# EAGLE design ISPnub_v1.1 (EAGLE 7.2.0)
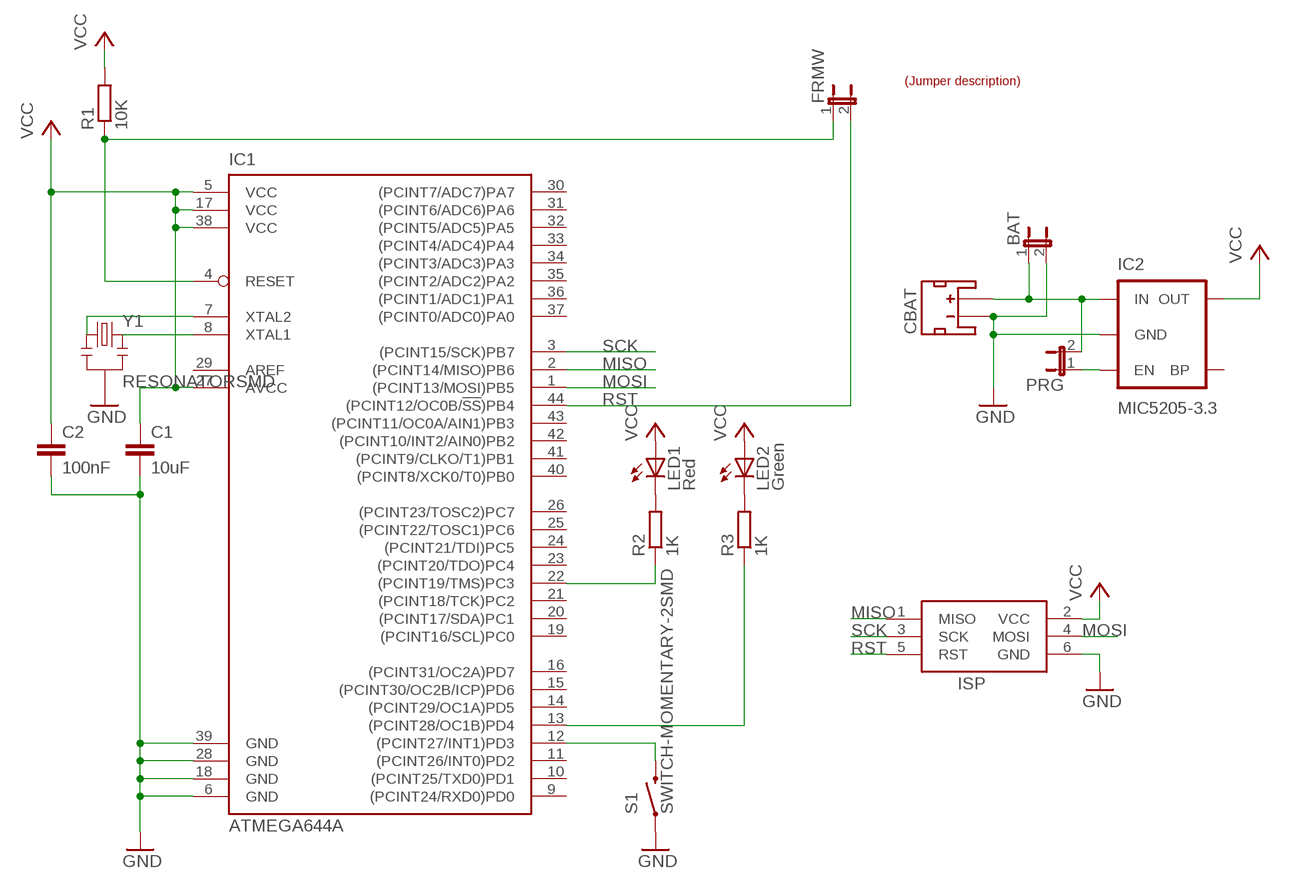
[diagram p0: schematic, sheet 1]

## Parts
BAT  JP1E  [JP1]
C1  10uF  C-EUC0805  [C0805]
C2  100nF  C-EUC0805  [C0805]
CBAT  JST PH SMT  JST_2MM_MALE  [JST-2-SMD]
FRMW  JP1E  [JP1]
IC1  ATMEGA644A  [TQFP44]
IC2  MIC5205-3.3  V_REG_LDOSMD  [SOT23-5]
ISP  AVRISP-6  [AVRISP]
LED1  Red  LEDCHIP-LED0805  [CHIP-LED0805]
LED2  Green  LEDCHIP-LED0805  [CHIP-LED0805]
PRG  JP1E  [JP1]
R1  10K  R-EU_R0805  [R0805]
R2  1K  R-EU_R0805  [R0805]
R3  1K  R-EU_R0805  [R0805]
S1  SWITCH-MOMENTARY-2SMD  [TACTILE_SWITCH_SMD]
U$1  LABEL_JUMPER_1X2  [JUMP2_DESC]
Y1  RESONATORSMD  [RESONATOR-SMD]

## Nets
GND: BAT.2 C1.2 C2.2 CBAT.1(-) IC1.6(GND) IC1.18(GND) IC1.28(GND) IC1.39(GND) IC2.2(GND) ISP.6(GND) S1.1 Y1.2
MISO: IC1.2((PCINT14/MISO)PB6) ISP.1(MISO)
MOSI: IC1.1((PCINT13/MOSI)PB5) ISP.4(MOSI)
N$1: FRMW.1 IC1.4(RESET) R1.1
N$2: IC1.8(XTAL1) Y1.3
N$3: IC1.7(XTAL2) Y1.1
N$4: IC1.12((PCINT27/INT1)PD3) S1.3
N$5: IC1.13((PCINT28/OC1B)PD4) R3.1
N$6: LED2.C R3.2
N$7: IC1.22((PCINT19/TMS)PC3) R2.1
N$8: LED1.C R2.2
N$9: BAT.1 CBAT.2(+) IC2.1(IN) PRG.2
N$10: IC2.3(EN) PRG.1
RST: FRMW.2 IC1.44((PCINT12/OC0B/!SS!)PB4) ISP.5(RST)
SCK: IC1.3((PCINT15/SCK)PB7) ISP.3(SCK)
VCC: C1.1 C2.1 IC1.5(VCC) IC1.17(VCC) IC1.27(AVCC) IC1.38(VCC) IC2.5(OUT) ISP.2(VCC) LED1.A LED2.A R1.2
Unconnected: CBAT.NC1(PAD1) CBAT.NC2(PAD2) IC1.9((PCINT24/RXD0)PD0) IC1.10((PCINT25/TXD0)PD1) IC1.11((PCINT26/INT0)PD2) IC1.14((PCINT29/OC1A)PD5) IC1.15((PCINT30/OC2B/ICP)PD6) IC1.16((PCINT31/OC2A)PD7) IC1.19((PCINT16/SCL)PC0) IC1.20((PCINT17/SDA)PC1) IC1.21((PCINT18/TCK)PC2) IC1.23((PCINT20/TDO)PC4) IC1.24((PCINT21/TDI)PC5) IC1.25((PCINT22/TOSC1)PC6) IC1.26((PCINT23/TOSC2)PC7) IC1.29(AREF) IC1.30((PCINT7/ADC7)PA7) IC1.31((PCINT6/ADC6)PA6) IC1.32((PCINT5/ADC5)PA5) IC1.33((PCINT4/ADC4)PA4) IC1.34((PCINT3/ADC3)PA3) IC1.35((PCINT2/ADC2)PA2) IC1.36((PCINT1/ADC1)PA1) IC1.37((PCINT0/ADC0)PA0) IC1.40((PCINT8/XCK0/T0)PB0) IC1.41((PCINT9/CLKO/T1)PB1) IC1.42((PCINT10/INT2/AIN0)PB2) IC1.43((PCINT11/OC0A/AIN1)PB3) IC2.4(BP)

## Library data of the parts
BAT FRMW PRG = jumper:JP1E: JUMPER; MOUSER#: 571-826936-2
C1 C2 = rcl:C-EU: CAPACITOR, European symbol; MOUSER#: 80-C0805C104K5R
CBAT = SparkFun-Connectors:JST_2MM_MALE: Mates to single-cell LiPo batteries. CONN-08352; PROD_ID: CONN-08352
IC1 = atmel:ATMEGA644: 8-bit Microcontroller with 64K Bytes In-System Programmable Flash Source: http://www.atmel.com/dyn/resources/prod_documents/doc2593.pdf; MOUSER#: 556-ATMEGA1284P-AU; MPN: ATMEGA1284PV-10AU; OC_FARNELL: 1455123; OC_NEWARK: 58M3748
IC2 = Arduino-Pro-Mini-v14Arduino-Pro-Mini:V_REG_LDO: Voltage Regulator LDO Standard 150mA LDO voltage regulator in SOT-23 layout. Micrel part MIC5205. BP (by-pass) pin is used to lower output noise with 470pF cap.
ISP = adafruit:AVRISP: AVR ISP HEADER Standard 6 pin header for AVR programming
LED1 = led:LED: LED OSRAM: - CHIPLED LG R971, LG N971, LY N971, LG Q971, LY Q971, LO R971, LY R971 LH N974, LH R974 LS Q976, LO Q976, LY Q976 LO Q996 - Hyper CHIPLED LW Q18S LB Q993, LB Q99A, LB R99A - SideLED LS A670, LO A670, LY A670, LG A670, LP A670 LB A673, LV A673, LT A673, LW A673 LH A674 LY A675 LS A676, LA A676, LO A676, LY A676, LW A676 LS A679, LY A679, LG A679 - Hyper Micro SIDELED® LS Y876, LA Y876, LO Y876, LY Y876 LT Y87S - SmartLED LW L88C, LW L88S LB L89C, LB L89S, LG L890 LS L89K, LO L89K, LY L89K LS L896, LA L896, LO L896, LY L896 - TOPLED LS T670, LO T670, LY T670, LG T670, LP T670 LSG T670, LSP T670, LSY T670, LOP T670, LYG T670 LG T671, LOG T671, LSG T671 LB T673, LV T673, LT T673, LW T673 LH T674 LS T676, LA T676, LO T676, LY T676, LB T676, LH T676, LSB T676, LW T676 LB T67C, LV T67C, LT T67C, LS T67K, LO T67K, LY T67K, LW E67C LS E67B, LA E67B, LO E67B, LY E67B, LB E67C, LV E67C, LT E67C LW T67C LS T679, LY T679, LG T679 LS T770, LO T770, LY T770, LG T770, LP T770 LB T773, LV T773, LT T773, LW T773 LH T774 LS E675, LA E675, LY E675, LS T675 LS T776, LA T776, LO T776, LY T776, LB T776 LHGB T686 LT T68C, LB T68C - Hyper Mini TOPLED® LB M676 - Mini TOPLED Santana® LG M470 LS M47K, LO M47K, LY M47K Source: http://www.osram.convergy.de LUXEON: - LUMILED® LXK2-PW12-R00, LXK2-PW12-S00, LXK2-PW14-U00, LXK2-PW14-V00 LXK2-PM12-R00, LXK2-PM12-S00, LXK2-PM14-U00 LXK2-PE12-Q00, LXK2-PE12-R00, LXK2-PE12-S00, LXK2-PE14-T00, LXK2-PE14-U00 LXK2-PB12-K00, LXK2-PB12-L00, LXK2-PB12-M00, LXK2-PB14-N00, LXK2-PB14-P00, LXK2-PB14-Q00 LXK2-PR12-L00, LXK2-PR12-M00, LXK2-PR14-Q00, LXK2-PR14-R00 LXK2-PD12-Q00, LXK2-PD12-R00, LXK2-PD12-S00 LXK2-PH12-R00, LXK2-PH12-S00 LXK2-PL12-P00, LXK2-PL12-Q00, LXK2-PL12-R00 Source: www.luxeon.com KINGBRIGHT: KA-3528ASYC Source: www.kingbright.com; MOUSER#: 604-APT1608SURC
LED2 = led:LED: LED OSRAM: - CHIPLED LG R971, LG N971, LY N971, LG Q971, LY Q971, LO R971, LY R971 LH N974, LH R974 LS Q976, LO Q976, LY Q976 LO Q996 - Hyper CHIPLED LW Q18S LB Q993, LB Q99A, LB R99A - SideLED LS A670, LO A670, LY A670, LG A670, LP A670 LB A673, LV A673, LT A673, LW A673 LH A674 LY A675 LS A676, LA A676, LO A676, LY A676, LW A676 LS A679, LY A679, LG A679 - Hyper Micro SIDELED® LS Y876, LA Y876, LO Y876, LY Y876 LT Y87S - SmartLED LW L88C, LW L88S LB L89C, LB L89S, LG L890 LS L89K, LO L89K, LY L89K LS L896, LA L896, LO L896, LY L896 - TOPLED LS T670, LO T670, LY T670, LG T670, LP T670 LSG T670, LSP T670, LSY T670, LOP T670, LYG T670 LG T671, LOG T671, LSG T671 LB T673, LV T673, LT T673, LW T673 LH T674 LS T676, LA T676, LO T676, LY T676, LB T676, LH T676, LSB T676, LW T676 LB T67C, LV T67C, LT T67C, LS T67K, LO T67K, LY T67K, LW E67C LS E67B, LA E67B, LO E67B, LY E67B, LB E67C, LV E67C, LT E67C LW T67C LS T679, LY T679, LG T679 LS T770, LO T770, LY T770, LG T770, LP T770 LB T773, LV T773, LT T773, LW T773 LH T774 LS E675, LA E675, LY E675, LS T675 LS T776, LA T776, LO T776, LY T776, LB T776 LHGB T686 LT T68C, LB T68C - Hyper Mini TOPLED® LB M676 - Mini TOPLED Santana® LG M470 LS M47K, LO M47K, LY M47K Source: http://www.osram.convergy.de LUXEON: - LUMILED® LXK2-PW12-R00, LXK2-PW12-S00, LXK2-PW14-U00, LXK2-PW14-V00 LXK2-PM12-R00, LXK2-PM12-S00, LXK2-PM14-U00 LXK2-PE12-Q00, LXK2-PE12-R00, LXK2-PE12-S00, LXK2-PE14-T00, LXK2-PE14-U00 LXK2-PB12-K00, LXK2-PB12-L00, LXK2-PB12-M00, LXK2-PB14-N00, LXK2-PB14-P00, LXK2-PB14-Q00 LXK2-PR12-L00, LXK2-PR12-M00, LXK2-PR14-Q00, LXK2-PR14-R00 LXK2-PD12-Q00, LXK2-PD12-R00, LXK2-PD12-S00 LXK2-PH12-R00, LXK2-PH12-S00 LXK2-PL12-P00, LXK2-PL12-Q00, LXK2-PL12-R00 Source: www.luxeon.com KINGBRIGHT: KA-3528ASYC Source: www.kingbright.com; MOUSER#: 604-APT2012SGC
R1 = rcl:R-EU_: RESISTOR, European symbol; MOUSER#: 603-SR0805JR-0710KL
R2 R3 = rcl:R-EU_: RESISTOR, European symbol; MOUSER#: 71-CRCW0805-1.0K-E3
S1 = Arduino-Pro-Mini-v14Arduino-Pro-Mini:SWITCH-MOMENTARY-2: Various NO switches- pushbuttons, reed, etc; MOUSER#: 693-1301.9314; PROD_ID: SWCH-08247
U$1 = dp_devices:LABEL_JUMPER_1X2: Nice formatted two legged jumperdescription Use attributes to change the values ON = With jumper OFF = Without jumper; OFF: Normal; ON: Update Firmware
Y1 = Arduino-Pro-Mini-v14Arduino-Pro-Mini:RESONATOR: Resonator Small SMD resonator. This is the itty bitty 10/20MHz resonators with built in caps. CSTCE10M0G55 and CSTCE20M0V53. Footprint for SMD has been used in SFE production for years, and does work okay. 1:1 is an attempt to get larger fillets on the sides so it will be easier to inspect these solders in our AOI machine. The pads have been minimized to match the actual metal under the resonator. To see this relation, it includes an image import of the bottom side of the component. Imported to scale on layer 200.

## Board
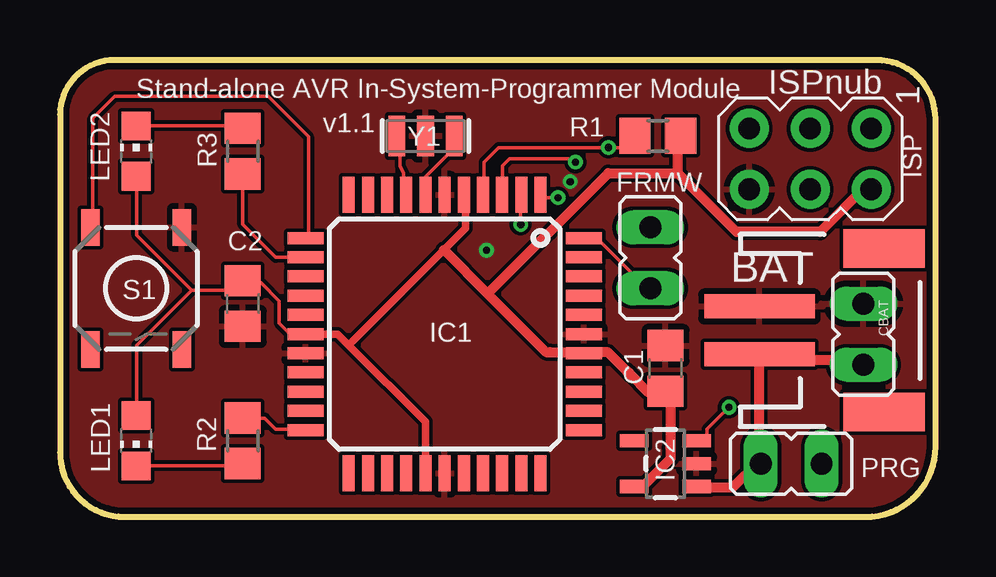
[diagram p1: board, top side]
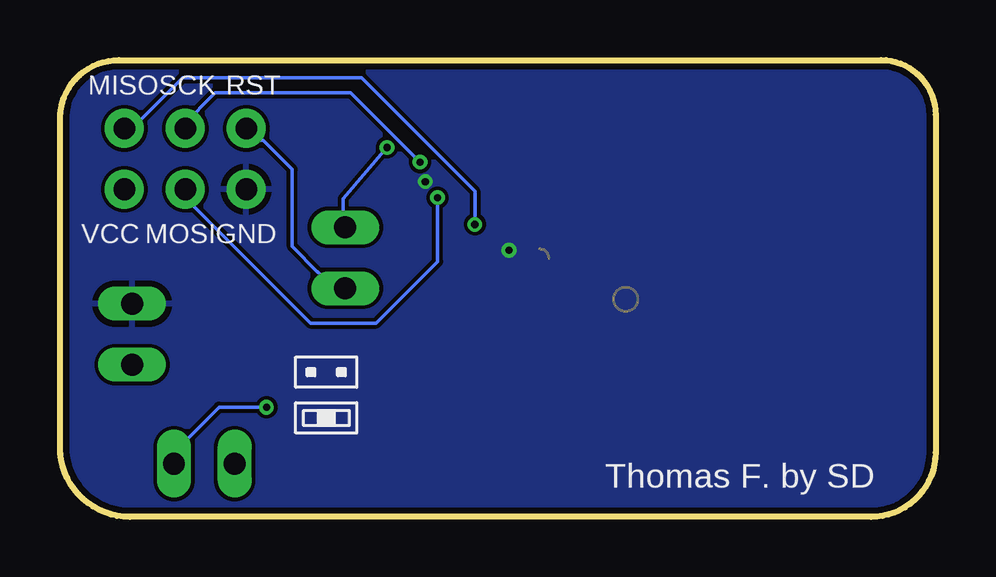
[diagram p2: board, bottom side, seen from below]

Size 36.5 x 19.04 mm. Coordinates in mm from the lower left corner, seen from the top.
Outline: 0,16.76 0,2.69 arc90 2.69,0 33.58,0 arc90 36.5,2.92 36.5,16.58 arc90 34.04,19.04 2.28,19.04 arc90 0,16.76
Copper layers (1*16): Top 0.035mm / dielectric 1.5mm / Bottom 0.035mm
Design rules "Elecrow_2-layer_eagle_rule": minimum track width 6mil, minimum drill 12mil, track to track 6mil, track to pad 6mil, pad to pad 6mil, via to via 6mil, smd to smd 0mil, copper to edge 10mil, drill to drill 10mil, minimum pad ring 10mil, minimum via ring 6mil, stop-mask expansion 2mil, vias tented up to drill 100mil, thermal gap 10mil

### Footprints (pad centres in the part's own frame; a part is rotated, then mirrored left to right if it is on the bottom)
JP1 = drill 0.914 long: 1 0,-1.27; 2 0,1.27
C0805 = smd 1.3 x 1.5: 1 -0.95,0; 2 0.95,0
JST-2-SMD = smd 1 x 4.6: 1 -1,-3.7; 2 1,-3.7 | smd 1.6 x 3.4: NC1 -3.4,1.5; NC2 3.4,1.5
TQFP44 = smd 1.5 x 0.5: 1 -5.8,4; 2 -5.8,3.2; 3 -5.8,2.4; 4 -5.8,1.6; 5 -5.8,0.8; 6 -5.8,0; 7 -5.8,-0.8; 8 -5.8,-1.6; 9 -5.8,-2.4; 10 -5.8,-3.2; 11 -5.8,-4; 23 5.8,-4; 24 5.8,-3.2; 25 5.8,-2.4; 26 5.8,-1.6; 27 5.8,-0.8; 28 5.8,0; 29 5.8,0.8; 30 5.8,1.6; 31 5.8,2.4; 32 5.8,3.2; 33 5.8,4 | smd 0.5 x 1.5: 12 -4,-5.8; 13 -3.2,-5.8; 14 -2.4,-5.8; 15 -1.6,-5.8; 16 -0.8,-5.8; 17 0,-5.8; 18 0.8,-5.8; 19 1.6,-5.8; 20 2.4,-5.8; 21 3.2,-5.8; 22 4,-5.8; 34 4,5.8; 35 3.2,5.8; 36 2.4,5.8; 37 1.6,5.8; 38 0.8,5.8; 39 0,5.8; 40 -0.8,5.8; 41 -1.6,5.8; 42 -2.4,5.8; 43 -3.2,5.8; 44 -4,5.8
SOT23-5 = smd 0.55 x 1.2: 1 -0.95,-1.3; 2 0,-1.3; 3 0.95,-1.3; 4 0.95,1.3; 5 -0.95,1.3
AVRISP = drill 0.9 pad 1.626: 1 -1.27,2.54; 2 1.27,2.54; 3 -1.27,0; 4 1.27,0; 5 -1.27,-2.54; 6 1.27,-2.54
CHIP-LED0805 = smd 1.2 x 1.2: A 0,-1.05; C 0,1.05
R0805 = smd 1.3 x 1.5: 1 -0.95,0; 2 0.95,0
TACTILE_SWITCH_SMD = smd 1.524 x 0.762: 1 -2.54,1.905; 2 2.54,1.905; 3 -2.54,-1.905; 4 2.54,-1.905
RESONATOR-SMD = smd 0.7 x 1.7: 1 -1.2,0; 2 0,0; 3 1.2,0

### Placement (x,y rotation side)
BAT  33.5,7.62 0 top
C1  25.24,6.19 90 top
C2  7.62,8.89 270 top
CBAT  32.86,7.78 270 top
FRMW  24.61,10.79 180 top
IC1  16.03,7.62 270 top
IC2  25.24,2.22 90 top
ISP  31.27,14.92 270 top
LED1  3.17,3.17 180 top
LED2  3.17,15.24 0 top
PRG  30.48,2.22 90 top
R1  24.92,15.88 0 top
R2  7.62,3.17 270 top
R3  7.62,15.24 90 top
S1  3.17,9.53 270 top
U$1  22.86,4.76 0 bottom
U$2  [LOGO]  20.32,8.57 0 bottom
Y1  15.24,15.88 180 top

### Tracks (layer width: path | path; a pad name or v marks a point on that pad's centre or on a via)
GND  (via drill 0.3)
  other vias: 17.78,11.11 21.27,13.97
  pour Top: 0,0 36.83,0 36.83,19.68 0,19.68
  pour Bottom: 0,0 36.83,0 36.83,19.68 0,19.68
MISO  (via drill 0.3)
  Top 0.152: v19.2,12.19 19.2,13.41 IC1.2
  Bottom 0.152: v19.2,12.19 19.2,13.58 23.93,18.3 31.38,18.3 33.38,16.31 33.68,16.31 ISP.1
MOSI  (via drill 0.3)
  Top 0.152: v20.76,13.3 20.12,13.3 20.12,13.41 IC1.1
  Bottom 0.152: v20.76,13.3 20.76,10.64 23.32,8.08 26.06,8.08 31.24,13.26 31.24,13.56 ISP.4
N$1  (via drill 0.3)
  Top 0.152: 22.71,15.39 23.32,15.39 23.77,15.85 R1.1 | 22.71,15.39 18.29,15.39 17.68,14.78 17.68,13.56 IC1.4 | 22.71,15.39 v22.87,15.4
  Bottom 0.152: v22.87,15.4 24.69,13.26 24.69,12.19 FRMW.1
N$2
  Top 0.152: IC1.8 14.33,13.56 14.33,14.33 14.19,14.62 14.17,15.09 14.17,15.85 Y1.3
N$3
  Top 0.152: IC1.7 15.24,13.56 15.24,14.17 15.7,14.63 15.7,14.62 16.31,15.23 16.31,15.85 Y1.1
N$4
  Top 0.152: IC1.12 10.36,11.73 10.36,15.85 8.69,17.53 2.29,17.53 1.37,16.61 1.37,12.19 S1.3
N$5
  Top 0.152: R3.1 7.62,12.19 8.99,10.82 10.21,10.82 IC1.13
N$6
  Top 0.152: LED2.C 3.2,16.31 7.62,16.31 R3.2
N$7
  Top 0.152: R2.1 8.53,4.12 8.98,3.66 9.14,3.66 9.45,3.66 10.21,3.66 IC1.22
N$8
  Top 0.152: LED1.C 3.2,2.13 7.62,2.13 R2.2
N$9
  Top 0.152: 26.98,1.22 IC2.1 | 29.11,7.01 29.13,6.56 | 29.11,2.29 PRG.2
  Top 0.406: 26.98,1.22 28.04,1.22 29.11,2.29 29.11,2.71 29.13,3.16 29.13,6.56 29.32,6.56 | 29.32,6.56 CBAT.2 | 29.32,6.56 33.5,6.56 BAT.1
N$10  (via drill 0.3)
  Top 0.152: v27.89,4.57 26.98,3.66 26.98,3.2 IC2.3
  Bottom 0.152: v27.89,4.57 29.87,4.57 31.7,2.74 31.7,2.29 PRG.1
RST
  Top 0.152: IC1.44 21.95,11.58 22.4,11.58 22.86,11.12 22.86,11.13 23.47,10.52 23.63,10.37 24.24,9.76 24.54,9.6 FRMW.2
  Bottom 0.152: ISP.5 28.65,16.15 28.19,15.7 28.04,15.7 26.82,14.48 26.82,11.27 25.76,10.2 25.76,10.21 25.15,9.6 24.69,9.6 FRMW.2
SCK  (via drill 0.3)
  Top 0.152: v21.49,14.78 21.34,14.94 18.75,14.94 18.44,14.63 18.44,13.56 IC1.3
  Bottom 0.152: v21.49,14.78 24.38,17.68 30.02,17.68 31.39,16.31 ISP.3
VCC
  Top 0.152: 25.76,15.85 R1.2 | 25.44,4.88 25.3,5.18 C1.1 25.15,5.18 24.54,5.18 | 21.95,6.86 IC1.38 21.79,6.86 | 5.49,9.45 3.2,7.16 3.2,4.27 LED1.A | 5.49,9.45 7.32,9.45 7.62,9.75 | 5.49,9.45 3.2,11.73 3.2,14.17 LED2.A | IC1.17 9.6,7.62 9.14,8.08 9.14,8.99 8.38,9.75 7.62,9.75 | 7.62,9.75 C2.1 | IC1.27 | 16.92,13.41 IC1.5
  Top 0.305: 33.38,13.56 33.68,13.56 ISP.2 | IC1.27 15.24,3.96 12.04,7.16 | 12.04,7.16 11.58,7.62 IC1.17 | 16.92,13.41 16.92,12.04 16,11.12 12.04,7.16
  Top 0.406: 25.76,14.33 25.76,15.85 | 25.76,14.33 28.2,11.88 31.69,11.88 33.38,13.56 | 25.44,4.88 25.44,2.9 25.45,2.74 25.45,2.43 24.38,1.36 24.38,1.37 IC2.5 | 21.95,6.86 22.85,6.86 23.62,6.1 23.77,5.94 24.54,5.18 | 21.79,6.86 20.73,6.86 20.41,6.86 20.26,6.86 17.83,9.3 | 16,11.12 17.83,9.3 | 25.76,14.33 22.86,14.33 17.83,9.3

### Text on the board
tNames: ISPnub | Stand-alone AVR In-System-Programmer Module | v1.1
bNames: RST | SCK | MISO | GND | MOSI | VCC | Thomas F. by SD